# Altium schematic sheet Stepper_control.SchDoc: Stepper Control
size A3; DrawnBy: Mogens Groth Nicolaisen; DocumentNumber: 4; SheetNumber: 4; SheetTotal: 7
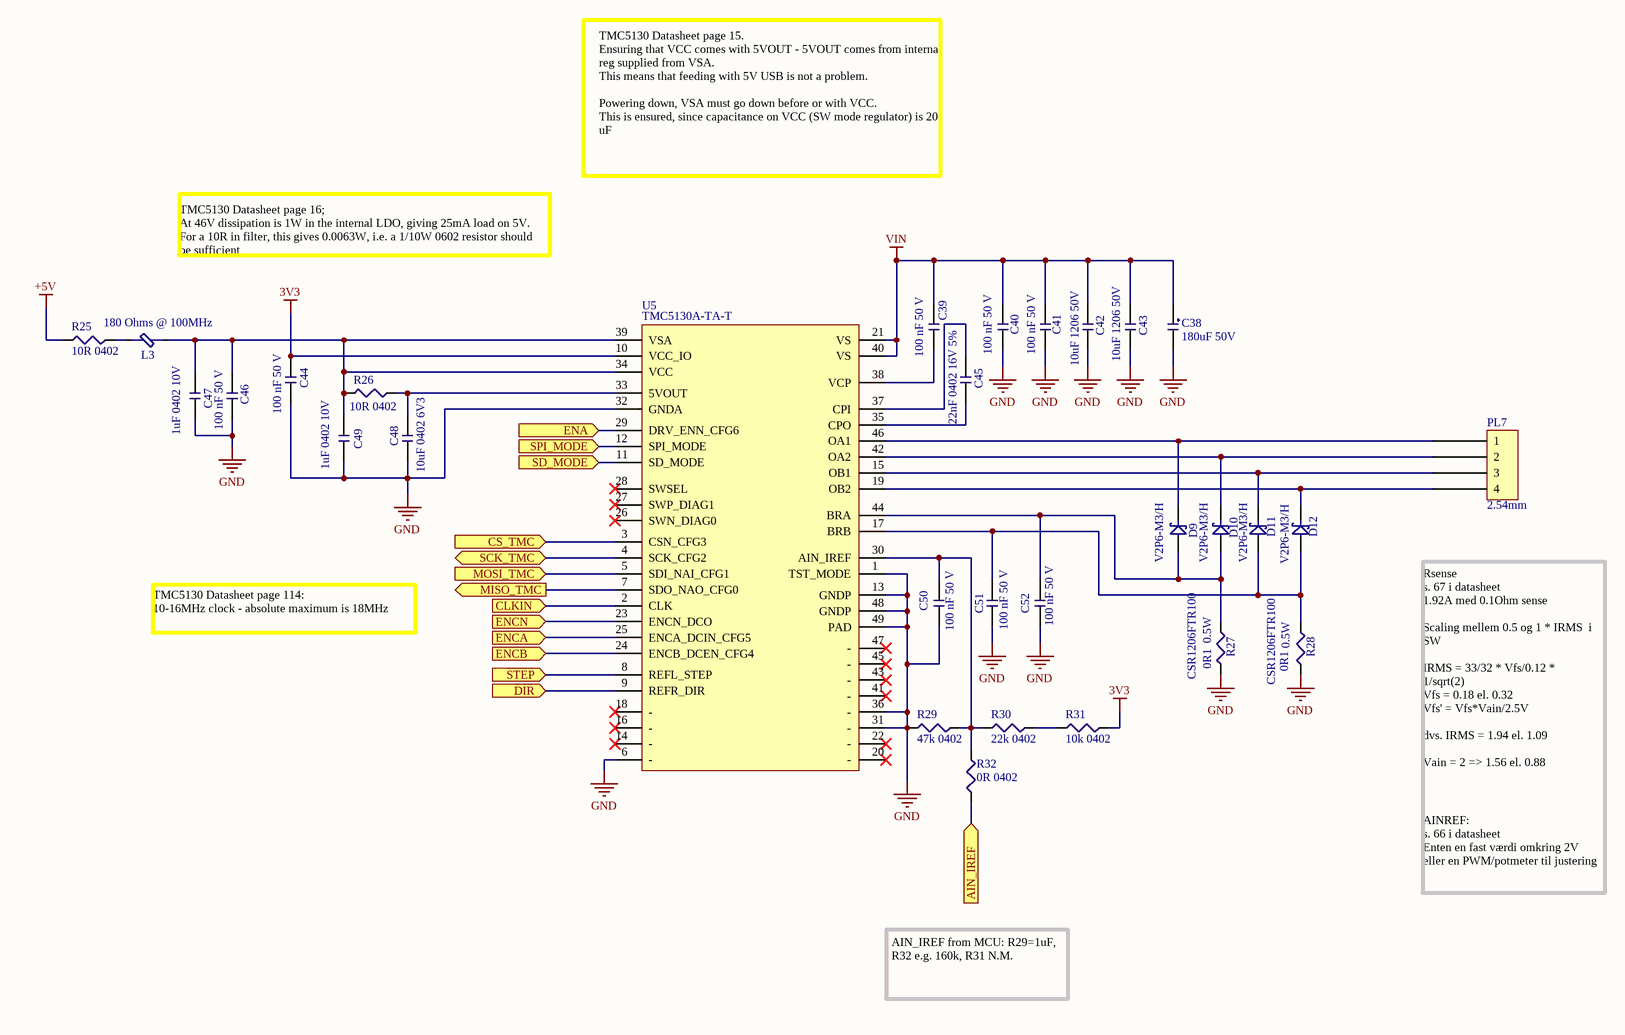
[diagram p0: Stepper_control.SchDoc]

## Parts
C38  180uF 50V  [Capacitor 8x22]
C39  100 nF 50 V  [CAP_0402]
C40  100 nF 50 V  [CAP_0402]
C41  100 nF 50 V  [CAP_0402]
C42  10uF 1206 50V  [CAP_1206]
C43  10uF 1206 50V  [CAP_1206]
C44  100 nF 50 V  [CAP_0402]
C45  22nF 0402 16V 5%  [CAP_0402]
C46  100 nF 50 V  [CAP_0402]
C47  1uF 0402 10V  [CAP_0402]
C48  10uF 0402 6V3  [CAP_0402]
C49  1uF 0402 10V  [CAP_0402]
C50  100 nF 50 V  [CAP_0402]
C51  100 nF 50 V  [CAP_0402]
C52  100 nF 50 V  [CAP_0402]
D9  V2P6-M3/H  [MicroSMP]
D10  V2P6-M3/H  [MicroSMP]
D11  V2P6-M3/H  [MicroSMP]
D12  V2P6-M3/H  [MicroSMP]
L3  180 Ohms @ 100MHz  [IND_0603]
PL7  2.54mm  [4-pin 2.54mm header]
R25  10R 0402  [RES_0402]
R26  10R 0402  [RES_0402]
R27  CSR1206FTR100  value 0R1  Power: 0.5W  [RES_1206]
R28  CSR1206FTR100  value 0R1  Power: 0.5W  [RES_1206]
R29  47k 0402  [RES_0402]
R30  22k 0402  [RES_0402]
R31  10k 0402  [RES_0402]
R32  0R 0402  [RES_0402]
U5  TMC5130A-TA-T  [TSQFP50P900X900X120_HS-49N]

## Ports
AIN_IREF (in), CLKIN (in), CS_TMC (in), DIR (in), ENA (in), ENCA (in), ENCB (in), ENCN (in), MISO_TMC (out), MOSI_TMC (in), SCK_TMC (bidir), SD_MODE (in), SPI_MODE (in), STEP (in)

## Nets
3V3: C44.1 R31.1 U5.10(VCC_IO)
+5V: R25.2
GND: C38.2 C40.2 C41.2 C42.2 C43.2 C44.2 C46.2 C47.1 C48.1 C49.1 C50.2 C51.2 C52.2 R27.1 R28.1 R29.2 U5.1(TST_MODE) U5.6(-) U5.13(GNDP) U5.31(-) U5.32(GNDA) U5.36(-) U5.48(GNDP) U5.49(PAD)
VIN: C38.1 C39.2 C40.1 C41.1 C42.1 C43.1 U5.21(VS) U5.40(VS)
AIN_IREF: R32.1 ; port AIN_IREF
CLKIN: U5.2(CLK) ; port CLKIN
CS_TMC: U5.3(CSN_CFG3) ; port CS_TMC
DIR: U5.9(REFR_DIR) ; port DIR
ENA: U5.29(DRV_ENN_CFG6) ; port ENA
ENCA: U5.25(ENCA_DCIN_CFG5) ; port ENCA
ENCB: U5.24(ENCB_DCEN_CFG4) ; port ENCB
ENCN: U5.23(ENCN_DCO) ; port ENCN
MISO_TMC: U5.7(SDO_NAO_CFG0) ; port MISO_TMC
MOSI_TMC: U5.5(SDI_NAI_CFG1) ; port MOSI_TMC
SCK_TMC: U5.4(SCK_CFG2) ; port SCK_TMC
SD_MODE: U5.11(SD_MODE) ; port SD_MODE
SPI_MODE: U5.12(SPI_MODE) ; port SPI_MODE
STEP: U5.8(REFL_STEP) ; port STEP
NetC39_1: C39.1 U5.38(VCP)
NetC45_1: C45.1 U5.35(CPO)
NetC45_2: C45.2 U5.37(CPI)
NetC46_1: C46.1 C47.2 C49.2 L3.2 R26.1 U5.34(VCC) U5.39(VSA)
NetC48_2: C48.2 R26.2 U5.33(5VOUT)
NetC50_1: C50.1 R29.1 R30.1 R32.2 U5.30(AIN_IREF)
NetC51_1: C51.1 D11.1 D12.1 R28.2 U5.17(BRB)
NetC52_1: C52.1 D9.1 D10.1 R27.2 U5.44(BRA)
NetD9_2: D9.2 PL7.1 U5.46(OA1)
NetD10_2: D10.2 PL7.2 U5.42(OA2)
NetD11_2: D11.2 PL7.3 U5.15(OB1)
NetD12_2: D12.2 PL7.4 U5.19(OB2)
NetL3_1: L3.1 R25.1
NetR30_2: R30.2 R31.2

Not connected (* = marked no-connect by the designer): U5 14(-)* 16(-)* 18(-)* 20(-)* 22(-)* 26(SWN_DIAG0)* 27(SWP_DIAG1)* 28(SWSEL)* 41(-)* 43(-)* 45(-)* 47(-)*

## Notes on the sheet
- TMC5130 Datasheet page 15.
  Ensuring that VCC comes with 5VOUT - 5VOUT comes from internal reg supplied from VSA.
  This means that feeding with 5V USB is not a problem.
  Powering down, VSA must go down before or with VCC.
  This is ensured, since capacitance on VCC (SW mode regulator) is 20 uF
- TMC5130 Datasheet page 16;
  At 46V dissipation is 1W in the internal LDO, giving 25mA load on 5V.
  For a 10R in filter, this gives 0.0063W, i.e. a 1/10W 0602 resistor should be sufficient
- TMC5130 Datasheet page 114:
  10-16MHz clock - absolute maximum is 18MHz
- Rsense
  s. 67 i datasheet
  1.92A med 0.1Ohm sense
  Scaling mellem 0.5 og 1 * IRMS  i SW
  IRMS = 33/32 * Vfs/0.12 * 1/sqrt(2)
  Vfs = 0.18 el. 0.32
  Vfs' = Vfs*Vain/2.5V
  dvs. IRMS = 1.94 el. 1.09
  Vain = 2 => 1.56 el. 0.88
- AINREF:
  s. 66 i datasheet
  Enten en fast værdi omkring 2V eller en PWM/potmeter til justering
- AIN_IREF from MCU: R29=1uF, R32 e.g. 160k, R31 N.M.
- ON Development
- Title:
- Size:
- A3
- Drawn By:
- Date:
- Sheet
- of
- Revision:

## Library data of the parts
C38 = CMP-002-0003-4: 180UF 20% 50V 105DEG RADIAL; Case/Package: -; Tolerance: 20%; Value: 180uF
C39-C41 C44 C46 C50 = CMP-00088-2: Multilayer Ceramic Capacitors MLCC - SMD/SMT .1uF 50Volts X7R +/-10% 0402 STD; Tolerance: 10%; Value: 100nF; Voltage: 50 V; Voltage Rating: 50V; Mount: Surface Mount; Case/Package: 0402; Case Code (Imperial): 0402; Case Code (Metric): 1005; Min Operating Temperature: -55°C; Max Operating Temperature: 125°C; Capacitance: 100nF; Voltage Rating (DC): 50V; Packaging: Tape and Reel; Package Quantity: 10000; Dielectric: X7R; Termination: SMD/SMT; Length: 0.039inch; Height: 0.5mm; Width: 0.5mm; Thickness: 0.022inch; Lead Free: Lead Free; Halogen Free: Halogen Free
C42 C43 = CMP-00030-4: 10uF 1206 50V X5R 20%; Tolerance: +/- 20%; Value: 10uF; Voltage: 50 V
C45 = CMP-00176-1: 22nF 0402 16V X7R 5%; Mfg. Part Number: GRM155R71C223JA01D; Tolerance: 5%; Value: 22nF; Voltage: 16V
C47 C49 = CMP-00032-5: 1uF 0402 10V 10% X5R; Material: Ceramic; Tolerance: 10%; Value: 1 uF; Voltage: 10 V; Capacitance: 1uF; Case/Package: 0402; Case Code (Imperial): 0402; Case Code (Metric): 1005; Contact Plating: Tin; Depth: 0.5mm; Dielectric: X5R; Height: 0.5mm; Length: 1mm; Max Operating Temperature: 85°C; Min Operating Temperature: -55°C; Mount: Surface Mount; Package Quantity: 1; Packaging: Tape and Reel; Radiation Hardening: No; Thickness: 0.022inch; Voltage Rating: 10V; Width: 0.02inch
C48 = CMP-00011-3: 10uF 20% 0402 6V3 X6S; Current Rating: -; Tolerance: 20%; Value: 10uF; Voltage: 6V3
C51 C52 = CMP-00088-2: Multilayer Ceramic Capacitors MLCC - SMD/SMT .1uF 50Volts X7R +/-10% 0402 STD; Tolerance: 10%; Value: 100nF; Voltage: 50 V; Voltage Rating (DC): 50V; Capacitance: 100nF; Case/Package: 0402; Case Code (Imperial): 0402; Case Code (Metric): 1005; Dielectric: X7R; Halogen Free: Halogen Free; Height: 0.5mm; Lead Free: Lead Free; Length: 0.039inch; Max Operating Temperature: 125°C; Min Operating Temperature: -55°C; Mount: Surface Mount; Package Quantity: 10000; Packaging: Tape and Reel; Termination: SMD/SMT; Thickness: 0.022inch; Voltage Rating: 50V; Width: 0.5mm
D9-D12 = CMP-016-0002-2: DIODE SCHOTTKY 60V 2A MICROSMP
L3 = CMP-ROOT-0005-2: FERRITE BEAD 180 OHM 0603 1LN; Mfg. Part Number: BLM18PG181SN1D; Current: 1.5A; Value: 180 Ohm; Case/Package: 0603
PL7 = CMP-003-0003-3: Pin header 4-pin 2.54mm male; Mfg. Part Number: DS1021-1*4SF1-1
R25 R26 = CMP-001-0033-3: RES SMD 10 OHM 1% 1/16W 0402; Mfg. Part Number: 0402WGF100JTCE; Power: 63mW; Case/Package: 0402; Tolerance: 1%; Value: 10R
R27 R28 = CMP-001-0024-3: RES 0.1 OHM 1% 1/2W 1206; Case/Package: 1206; Tolerance: 1%; Mfg. Part Number: CSR1206FTR100
R29 = CMP-001-0027-3: RES SMD 47K OHM 1% 1/16W 0402; Mfg. Part Number: RMCF0402FT47K0; Case/Package: 0402; Power: 1/16W; Tolerance: 1%; Value: 47k
R30 = CMP-001-0026-3: RES SMD 22K OHM 1% 1/16W 0402; Mfg. Part Number: RMCF0402FT22K0; Case/Package: 0402; Power: 1/16W; Tolerance: 1%; Value: 22k
R31 = CMP-001-0019-3: RES SMD 10K OHM 1% 1/16W 0402; Mfg. Part Number: RMCF0402FT10K0; Case/Package: 0402; Power: 1/16 W; Tolerance: 1 %; Value: 10k
R32 = CMP-001-0055-1: RES SMD 0 OHM 1/16W 0402; Mfg. Part Number: RC0402JR-070RL; Power: 63mW; Case/Package: 0402; Tolerance: -; Value: 0R
U5 = CMP-00034-3: IC MOTOR CTLR/DVR SPI 48QFP; Mfg. Part Number: TMC5130A-TA-T